# EAGLE design DAC_PMOD (EAGLE 6.6.0)
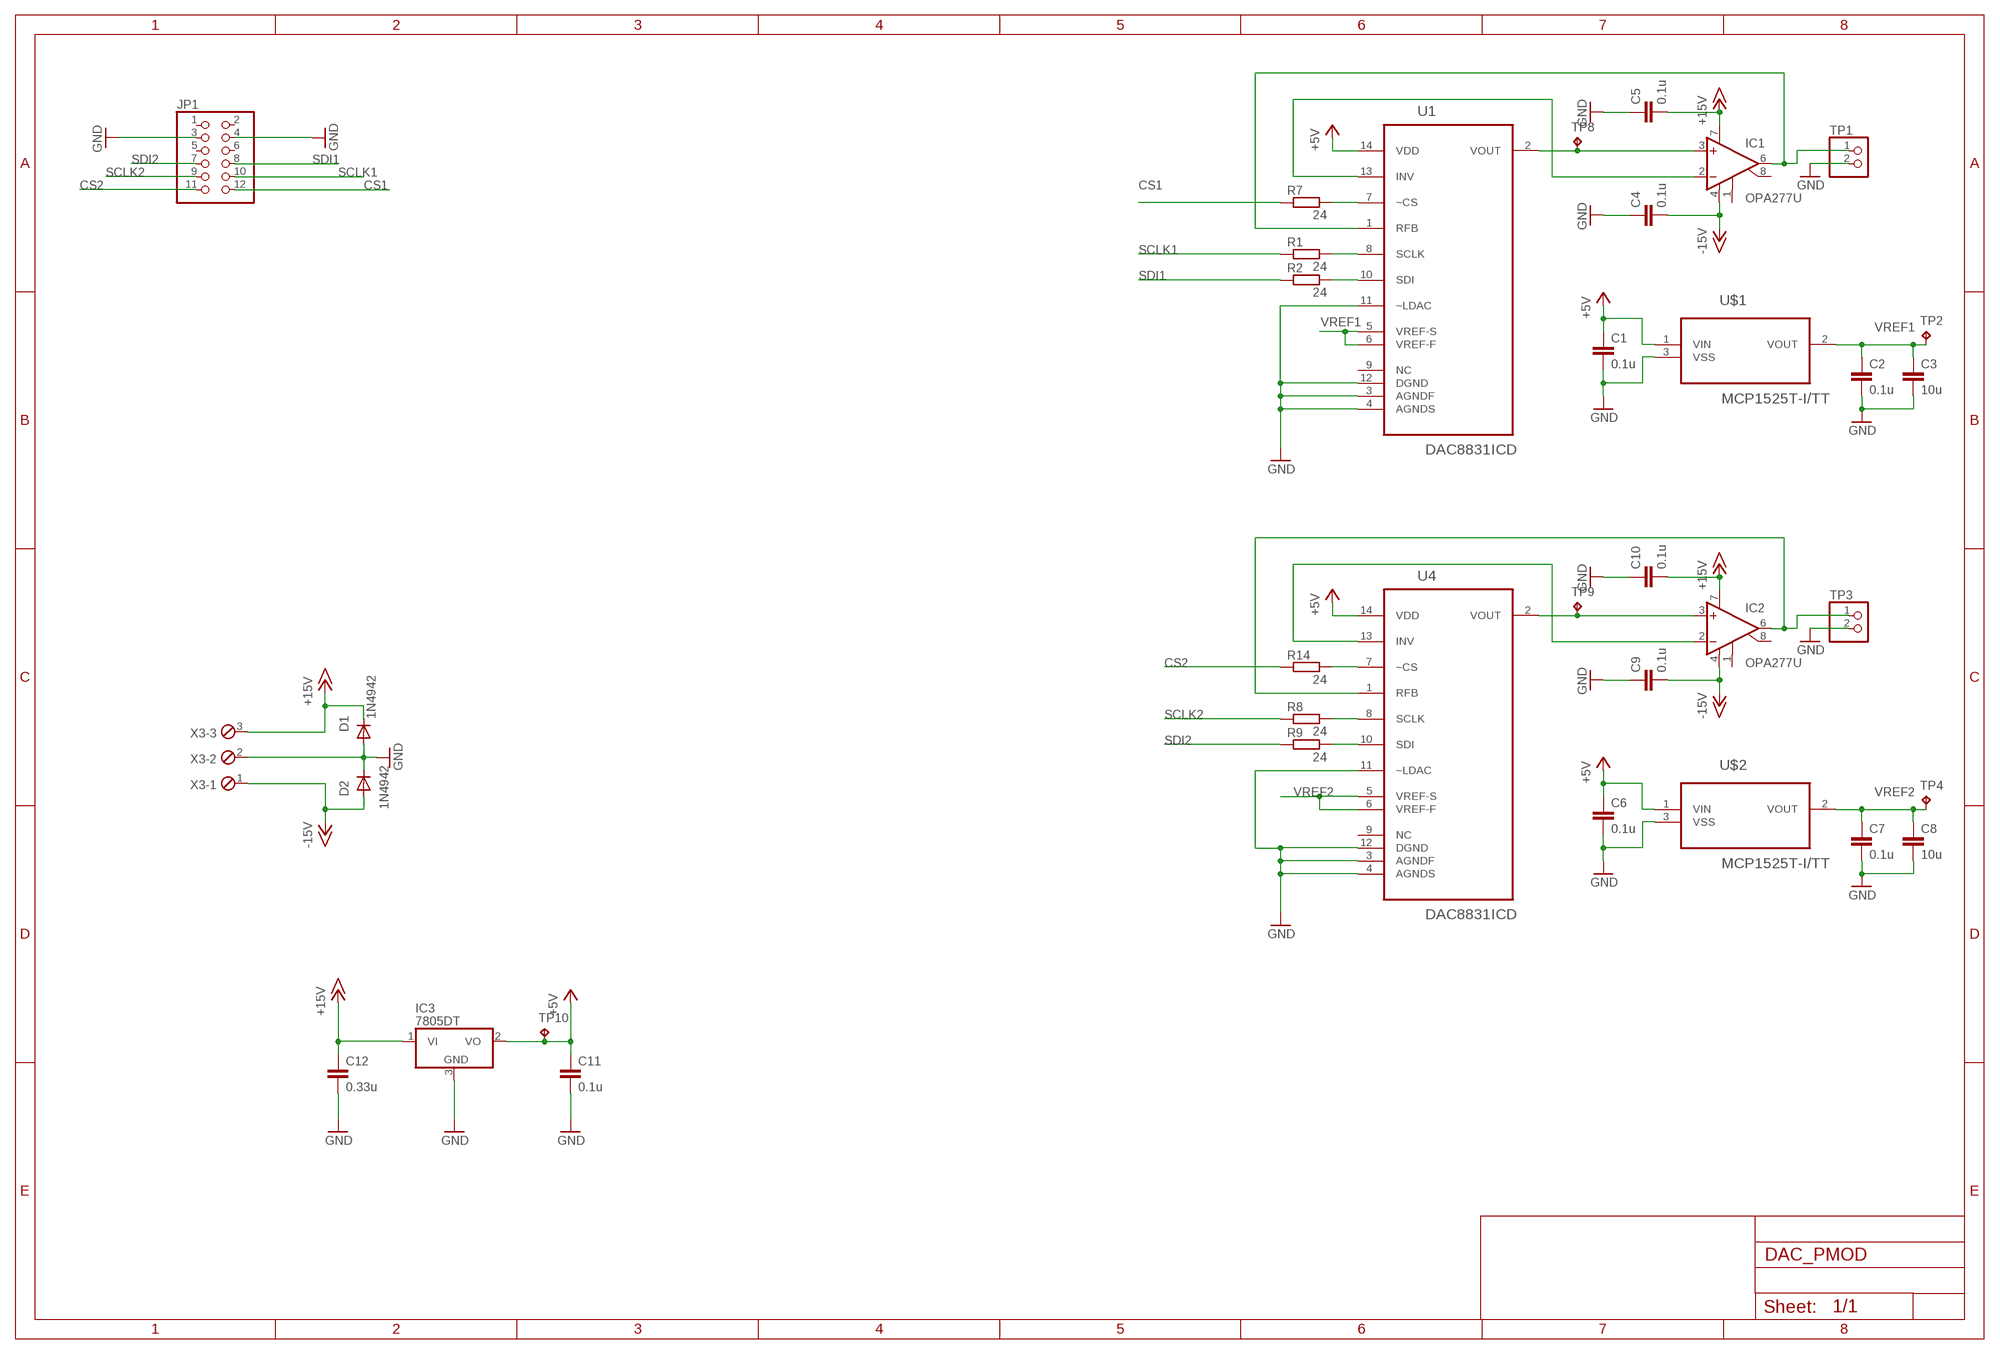
[diagram p0: schematic, sheet 1]

## Parts
C1  0.1u  C-EUC0603  [C0603]
C2  0.1u  C-EUC0603  [C0603]
C3  10u  C-EUC0603  [C0603]
C4  0.1u  C-EUC0603  [C0603]
C5  0.1u  C-EUC0603  [C0603]
C6  0.1u  C-EUC0603  [C0603]
C7  0.1u  C-EUC0603  [C0603]
C8  10u  C-EUC0603  [C0603]
C9  0.1u  C-EUC0603  [C0603]
C10  0.1u  C-EUC0603  [C0603]
C11  0.1u  C-EUC0603  [C0603]
C12  0.33u  C-EUC0603  [C0603]
D1  1N4942  [DO41-10]
D2  1N4942  [DO41-10]
IC1  OPA277U  [SO08]
IC2  OPA277U  [SO08]
IC3  7805DT  [TO252]
JP1  PINHD-2X6/90  [2X06/90]
R1  24  R-EU_R0603  [R0603]
R2  24  R-EU_R0603  [R0603]
R7  24  R-EU_R0603  [R0603]
R8  24  R-EU_R0603  [R0603]
R9  24  R-EU_R0603  [R0603]
R14  24  R-EU_R0603  [R0603]
TP1  PINHD-1X2  [1X02]
TP2  TPB1,27  [B1,27]
TP3  PINHD-1X2  [1X02]
TP4  TPB1,27  [B1,27]
TP8  TPB1,27  [B1,27]
TP9  TPB1,27  [B1,27]
TP10  TPB1,27  [B1,27]
U1  DAC8831ICD  [SOIC127P600X175-14N]
U4  DAC8831ICD  [SOIC127P600X175-14N]
U$1  MCP1525T-I/TT  [SOT96P237X112-3N]
U$2  MCP1525T-I/TT  [SOT96P237X112-3N]
X3  MPT3  [3POL254]

## Nets
+5V: C1.1 C6.1 C11.1 IC3.2(VO) TP10.TP U1.14(VDD) U4.14(VDD) U$1.1(VIN) U$2.1(VIN)
+15V: C5.2 C10.2 C12.1 D1.C IC1.7(V+) IC2.7(V+) IC3.1(VI) X3.3
-15V: C4.2 C9.2 D2.A IC1.4(V-) IC2.4(V-) X3.1
CS1: JP1.12 R7.1
CS2: JP1.11 R14.1
GND: C1.2 C2.2 C3.2 C4.1 C5.1 C6.2 C7.2 C8.2 C9.1 C10.1 C11.2 C12.2 D1.A D2.C IC3.3(GND) JP1.3 JP1.4 TP1.2 TP3.2 U1.3(AGNDF) U1.4(AGNDS) U1.11(~LDAC) U1.12(DGND) U4.3(AGNDF) U4.4(AGNDS) U4.11(~LDAC) U4.12(DGND) U$1.3(VSS) U$2.3(VSS) X3.2
N$1: IC1.3(+IN) TP8.TP U1.2(VOUT)
N$2: IC1.2(-IN) U1.13(INV)
N$3: IC1.6(OUT) TP1.1 U1.1(RFB)
N$5: R1.2 U1.8(SCLK)
N$6: R2.2 U1.10(SDI)
N$17: IC2.3(+IN) TP9.TP U4.2(VOUT)
N$27: R7.2 U1.7(~CS)
N$29: IC2.2(-IN) U4.13(INV)
N$30: IC2.6(OUT) TP3.1 U4.1(RFB)
N$32: R8.2 U4.8(SCLK)
N$33: R9.2 U4.10(SDI)
N$52: R14.2 U4.7(~CS)
SCLK1: JP1.10 R1.1
SCLK2: JP1.9 R8.1
SDI1: JP1.8 R2.1
SDI2: JP1.7 R9.1
VREF1: C2.1 C3.1 TP2.TP U1.5(VREF-S) U1.6(VREF-F) U$1.2(VOUT)
VREF2: C7.1 C8.1 TP4.TP U4.5(VREF-S) U4.6(VREF-F) U$2.2(VOUT)
Unconnected: IC1.1(CMP1) IC1.8(CMP2) IC2.1(CMP1) IC2.8(CMP2) JP1.1 JP1.2 JP1.5 JP1.6 U1.9(NC) U4.9(NC)

## Library data of the parts
C1-C12 = rcl:C-EU: CAPACITOR, European symbol
D1 D2 = diode:1N4942: DIODE 1.0 A, 200 V, 150 ns
IC1 IC2 = linear:OPA277: High Precision OPERATIONAL AMPLIFIERS REPLACES OP-07, OP-77, OP-177 Source: opa277.pdf
IC3 = linear:78*: Positive VOLTAGE REGULATOR Source: http://cache.national.com/ds/LM/LM78L05.pdf http://www.fairchildsemi.com/ds/LM/LM7805.pdf
JP1 = pinhead:PINHD-2X6: PIN HEADER
R1 R2 R7-R9 R14 = rcl:R-EU_: RESISTOR, European symbol
TP1 TP3 = pinhead:PINHD-1X2: PIN HEADER
TP2 TP4 TP8-TP10 = testpad:TP: Test pad
U1 U4 = Texas Instruments_By_element14_Batch_1:DAC8831ICD: 16-Bit, Ultra-Low Power, Voltage-Output Digital-to-Analog Converters; MPN: DAC8831ICD; OC_FARNELL: 1407780; OC_NEWARK: 33K5140; PACKAGE: SOIC-14; SUPPLIER: Texas Instruments
U$1 U$2 = Microchip_By_element14_Batch_1:MCP1525T-I/TT: Voltage References; MPN: MCP1525T-I/TT; OC_FARNELL: 9758500; OC_NEWARK: 89C7118; PACKAGE: SOT-3; SUPPLIER: Microchip
X3 = con-phoenix-254:MPT3: PHOENIX CONNECTOR; OC_FARNELL: unknown; OC_NEWARK: unknown

## Board
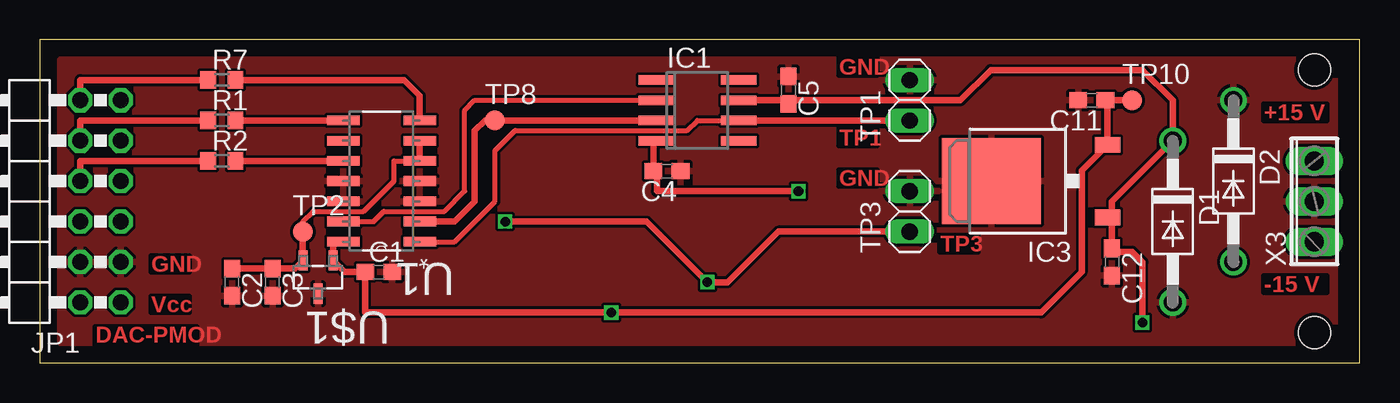
[diagram p1: board, top side]
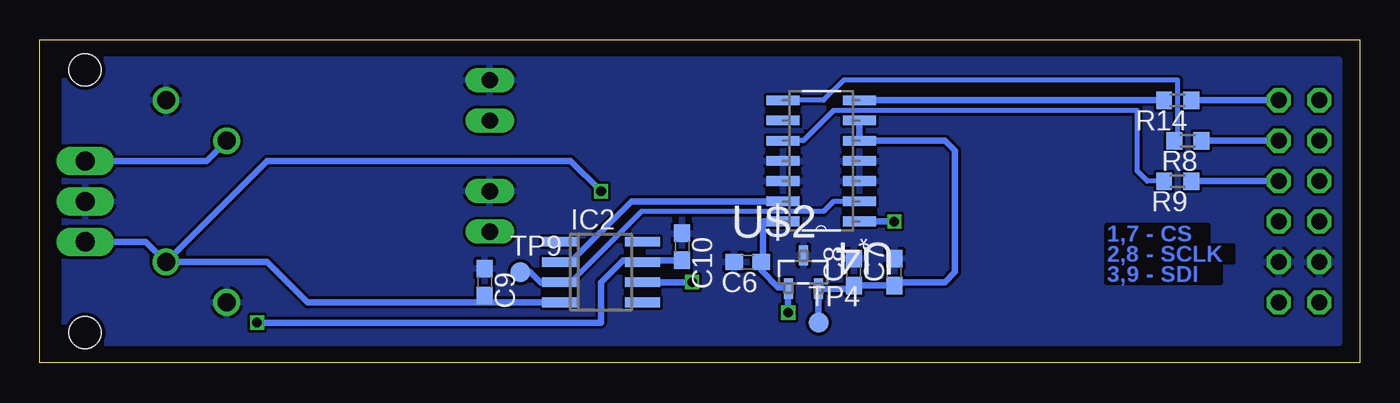
[diagram p2: board, bottom side, seen from below]

Size 82.86 x 20.31 mm. Coordinates in mm from the lower left corner, seen from the top.
Outline: 0,0 82.86,0 82.86,20.31 0,20.31 0,0
Copper layers (1*16): Top 0.035mm / dielectric 1.55mm / Bottom 0.035mm
Design rules "eC_2Layer_PClass6_BaseCopperO35": minimum track width 0.15mm, minimum drill 0.35mm, track to track 0.175mm, track to pad 0.175mm, pad to pad 0.175mm, via to via 0.175mm, smd to smd 0mil, copper to edge 0.25mm, drill to drill 0.35mm, minimum pad ring 0.175mm, minimum via ring 0.125mm, stop-mask expansion 0mil, vias tented up to drill 0.45mm, thermal gap 0.2mm
Holes 2 mm at 80.01,18.41 80.01,1.91

### Footprints (pad centres in the part's own frame; a part is rotated, then mirrored left to right if it is on the bottom)
C0603 = smd 1.1 x 1: 1 -0.85,0; 2 0.85,0
DO41-10 = drill 1.118: A 5.08,0; C -5.08,0
SO08 = smd 0.6 x 2.2: 1 -1.905,-2.6; 2 -0.635,-2.6; 3 0.635,-2.6; 4 1.905,-2.6; 5 1.905,2.6; 6 0.635,2.6; 7 -0.635,2.6; 8 -1.905,2.6
TO252 = smd 1 x 1.6: 1 -2.28,-4.8; 2 2.28,-4.8 | smd 5.4 x 6.2: 3 0,2.5
2X06/90 = drill 1.016 octagon: 1 -6.35,-6.35; 2 -6.35,-3.81; 3 -3.81,-6.35; 4 -3.81,-3.81; 5 -1.27,-6.35; 6 -1.27,-3.81; 7 1.27,-6.35; 8 1.27,-3.81; 9 3.81,-6.35; 10 3.81,-3.81; 11 6.35,-6.35; 12 6.35,-3.81
R0603 = smd 1 x 1.1: 1 -0.85,0; 2 0.85,0
1X02 = drill 1.016 long: 1 -1.27,0; 2 1.27,0
B1,27 = smd 1.27 x 1.27: TP 0,0
SOIC127P600X175-14N = smd 2.057 x 0.61: 1 -4.801,7.62; 2 -4.801,6.35; 3 -4.801,5.08; 4 -4.801,3.81; 5 -4.801,2.54; 6 -4.801,1.27; 7 -4.801,0; 8 0,0; 9 0,1.27; 10 0,2.54; 11 0,3.81; 12 0,5.08; 13 0,6.35; 14 0,7.62
SOT96P237X112-3N = smd 0.559 x 1.27: 1 -0.94,-1.041; 2 0.94,-1.041; 3 0,1.041
3POL254 = drill 1.2 long: 1 -2.54,0; 2 0,0; 3 2.54,0

### Placement (x,y rotation side)
C1  21.27,5.71 0 top
C2  12.06,5.08 270 top
C3  14.61,5.08 270 top
C4  39.37,12.06 180 top
C5  46.99,17.14 270 top
C6  38.42,6.35 180 bottom
C7  29.21,5.71 90 bottom
C8  31.75,5.71 90 bottom
C9  54.93,5.08 270 bottom
C10  42.55,7.3 270 bottom
C11  66.04,16.51 180 top
C12  67.31,6.35 270 top
D1  71.12,8.89 270 top
D2  74.93,11.43 270 top
IC1  41.27,15.88 270 top
IC2  47.62,5.71 270 bottom
IC3  62.23,11.43 90 top
JP1  -1.27,10.16 90 top
R1  11.43,15.24 0 top
R2  11.43,12.7 0 top
R7  11.43,17.78 0 top
R8  10.79,13.97 180 bottom
R9  11.43,11.43 180 bottom
R14  11.43,16.51 180 bottom
TP1  54.61,16.51 90 top
TP2  16.51,8.26 0 top
TP3  54.61,9.53 90 top
TP4  33.97,2.54 0 bottom
TP8  28.57,15.24 0 top
TP9  52.7,5.71 0 bottom
TP10  68.58,16.51 0 top
U1  19.05,15.24 180 top
U4  36.2,16.51 180 bottom
U$1  17.46,5.4 180 top
U$2  34.92,5.71 0 bottom
X3  80.01,10.16 90 top

### Tracks (layer width: path | path; a pad name or v marks a point on that pad's centre or on a via)
+5V  (via drill 0.6)
  Top 0.406: IC3.2 67.03,16.37 arc90 C11.1 TP10.TP | U1.14 18.4,7.62 U$1.1 19.13,5.71 C1.1 20.42,3.17 v35.88,3.17 62.87,3.17 65.41,5.71 65.41,12.08 IC3.2 | IC3.2 67.03,16.16 66.67,16.51
  Bottom 0.406: U4.14 37.47,8.89 37.47,6.45 C6.1 37.57,5.82 36.51,4.76 35.95,4.76 U$2.1 35.88,4.67 v35.88,3.17
+15V  (via drill 0.6)
  Top 0.406: IC1.7 46.77,16.51 C5.2 47.2,16.51 57.78,16.51 59.69,18.41 69.22,18.41 71.12,16.51 D1.C 67.31,10.16 67.31,9.43 IC3.1 67.31,8.87 C12.1 67.53,6.98 68.58,6.98 69.22,6.35 v69.22,2.54
  Bottom 0.406: X3.3 72.39,12.7 D1.C | IC2.7 44.92,6.45 | 44.92,6.45 C10.2 | 44.92,6.45 46.25,6.45 47.62,5.08 47.62,2.54 v69.22,2.54
-15V  (via drill 0.6)
  Top 0.406: IC1.4 38.52,13.81 C4.2 38.73,11.85 38.73,10.79 v47.62,10.79
  Bottom 0.305: IC2.4 50.8,3.81
  Bottom 0.406: X3.1 76.2,7.62 D2.A | D2.A 68.58,6.35 66.04,3.81 54.61,3.81 | 50.53,3.81 50.8,3.81 54.61,3.81 | v47.62,10.79 49.53,12.7 68.58,12.7 D2.A | C9.2 54.93,4.13 54.61,3.81
CS1
  Top 0.406: JP1.12 2.54,17.78 R7.1
CS2
  Bottom 0.406: R14.1 JP1.11
GND
  pour Bottom: 81.28,19.05 81.28,1.27 1.27,1.27 1.27,19.05
  pour Top: 81.28,19.05 1.27,19.05 1.27,1.27 81.28,1.27
N$1
  Top 0.406: U1.2 26.04,8.89 27.3,10.16 27.3,14.61 27.94,15.24 TP8.TP IC1.3
N$2
  Top 0.305: U1.13 20.95,8.89 21.59,9.53 25.4,9.53 26.67,10.79 26.67,15.88 27.3,16.51 IC1.2
N$3
  Top 0.305: U1.1 26.04,7.62 28.57,10.16 28.57,13.33 29.84,14.61 40.64,14.61 41.27,15.24 IC1.6
  Top 0.406: IC1.6 TP1.1
N$5
  Top 0.406: R1.2 U1.8
N$6
  Top 0.406: R2.2 U1.10
N$17
  Bottom 0.305: U4.2 33.02,10.16 33.66,9.53 45.09,9.53 49.53,5.08 IC2.3
  Bottom 0.406: TP9.TP 52.07,5.71 51.44,5.08 IC2.3
N$27
  Top 0.406: R7.2 22.86,17.78 23.85,16.79 U1.7
N$29
  Bottom 0.406: U4.13 45.72,10.16 49.53,6.35 IC2.2
N$30  (via drill 0.6)
  Top 0.406: v29.21,8.89 38.1,8.89 v41.91,5.08 43.18,5.08 46.35,8.26 TP3.1
  Bottom 0.406: U4.1 v29.21,8.89 | v41.91,5.08 IC2.6
N$32
  Bottom 0.305: R8.2 11.43,13.97 11.43,17.78 32.38,17.78 33.66,16.51 U4.8
N$33
  Bottom 0.305: R9.2 13.34,11.43 13.97,12.06 13.97,15.88 33.02,15.88 34.92,13.97 U4.10
N$52
  Bottom 0.406: R14.2 U4.7
SCLK1
  Top 0.406: JP1.10 2.54,15.24 R1.1
SCLK2
  Bottom 0.406: R8.1 JP1.9
SDI1
  Top 0.406: JP1.8 2.54,12.7 R2.1
SDI2
  Bottom 0.406: R9.1 JP1.7
VREF1
  Top 0.305: TP2.TP 16.51,8.89 17.14,9.53 20.32,9.53 22.23,11.43 22.23,12.7 U1.5
  Top 0.406: U1.5 U1.6 | C2.1 C3.1 16.01,5.93 U$1.2 16.51,6.45 TP2.TP
VREF2
  Bottom 0.406: TP4.TP arc90 33.98,2.87 U$2.2 31.94,4.67 C8.1 C7.1 29,5.08 26.04,5.08 25.4,5.71 25.4,13.33 26.04,13.97 U4.5 U4.6

### Text on the board
Top: GND | +15 V | TP1 | GND | TP3 | GND | -15 V | Vcc | DAC-PMOD
Bottom: 1,7 - CS | 2,8 - SCLK | 3,9 - SDI